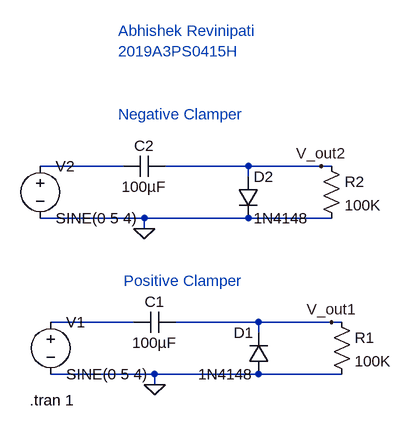
[diagram p0: schematic 2019A3PS0415_clamper.asc]
2019A3PS0415_clamper.asc, the LTspice schematic file:
Version 4
SHEET 1 880 680
WIRE 112 -112 -16 -112
WIRE 304 -112 176 -112
WIRE 416 -112 304 -112
WIRE 432 -112 416 -112
WIRE 304 -96 304 -112
WIRE 144 -32 -16 -32
WIRE 304 -32 144 -32
WIRE 432 -32 304 -32
WIRE 144 -16 144 -32
WIRE 128 128 0 128
WIRE 320 128 192 128
WIRE 432 128 320 128
WIRE 448 128 432 128
WIRE 320 144 320 128
WIRE 160 208 0 208
WIRE 320 208 160 208
WIRE 448 208 320 208
WIRE 160 224 160 208
FLAG 160 224 0
FLAG 432 128 V_out1
FLAG 144 -16 0
FLAG 416 -112 V_out2
SYMBOL voltage 0 112 R0
WINDOW 123 0 0 Left 0
WINDOW 39 0 0 Left 0
SYMATTR InstName V1
SYMATTR Value SINE(0 5 4)
SYMBOL cap 192 112 R90
WINDOW 0 0 32 VBottom 2
WINDOW 3 32 32 VTop 2
SYMATTR InstName C1
SYMATTR Value 100µF
SYMBOL diode 336 208 R180
WINDOW 0 24 64 Left 2
WINDOW 3 24 0 Left 2
SYMATTR InstName D1
SYMATTR Value 1N4148
SYMBOL res 432 112 R0
SYMATTR InstName R1
SYMATTR Value 100K
SYMBOL voltage -16 -128 R0
WINDOW 123 0 0 Left 0
WINDOW 39 0 0 Left 0
SYMATTR InstName V2
SYMATTR Value SINE(0 5 4)
SYMBOL cap 176 -128 R90
WINDOW 0 0 32 VBottom 2
WINDOW 3 32 32 VTop 2
SYMATTR InstName C2
SYMATTR Value 100µF
SYMBOL diode 288 -96 R0
SYMATTR InstName D2
SYMATTR Value 1N4148
SYMBOL res 416 -128 R0
SYMATTR InstName R2
SYMATTR Value 100K
TEXT -32 248 Left 2 !.tran 1
TEXT 104 -192 Left 2 ;Negative Clamper
TEXT 112 64 Left 2 ;Positive Clamper
TEXT 104 -320 Left 2 ;Abhishek Revinipati\n2019A3PS0415H

The netlist it stands for:
* 2019A3PS0415_clamper.asc
V1 N002 0 SINE(0 5 4)
C1 V_out1 N002 100µF
D1 0 V_out1 1N4148
R1 V_out1 0 100K
V2 N001 0 SINE(0 5 4)
C2 V_out2 N001 100µF
D2 V_out2 0 1N4148
R2 V_out2 0 100K
.model D D
.lib standard.dio
.tran 1
* Negative Clamper
* Positive Clamper
* Abhishek Revinipati
* 2019A3PS0415H
.backanno
.end